# EAGLE design EthernetAppBoard-0BAC0403 (EAGLE 5.10)
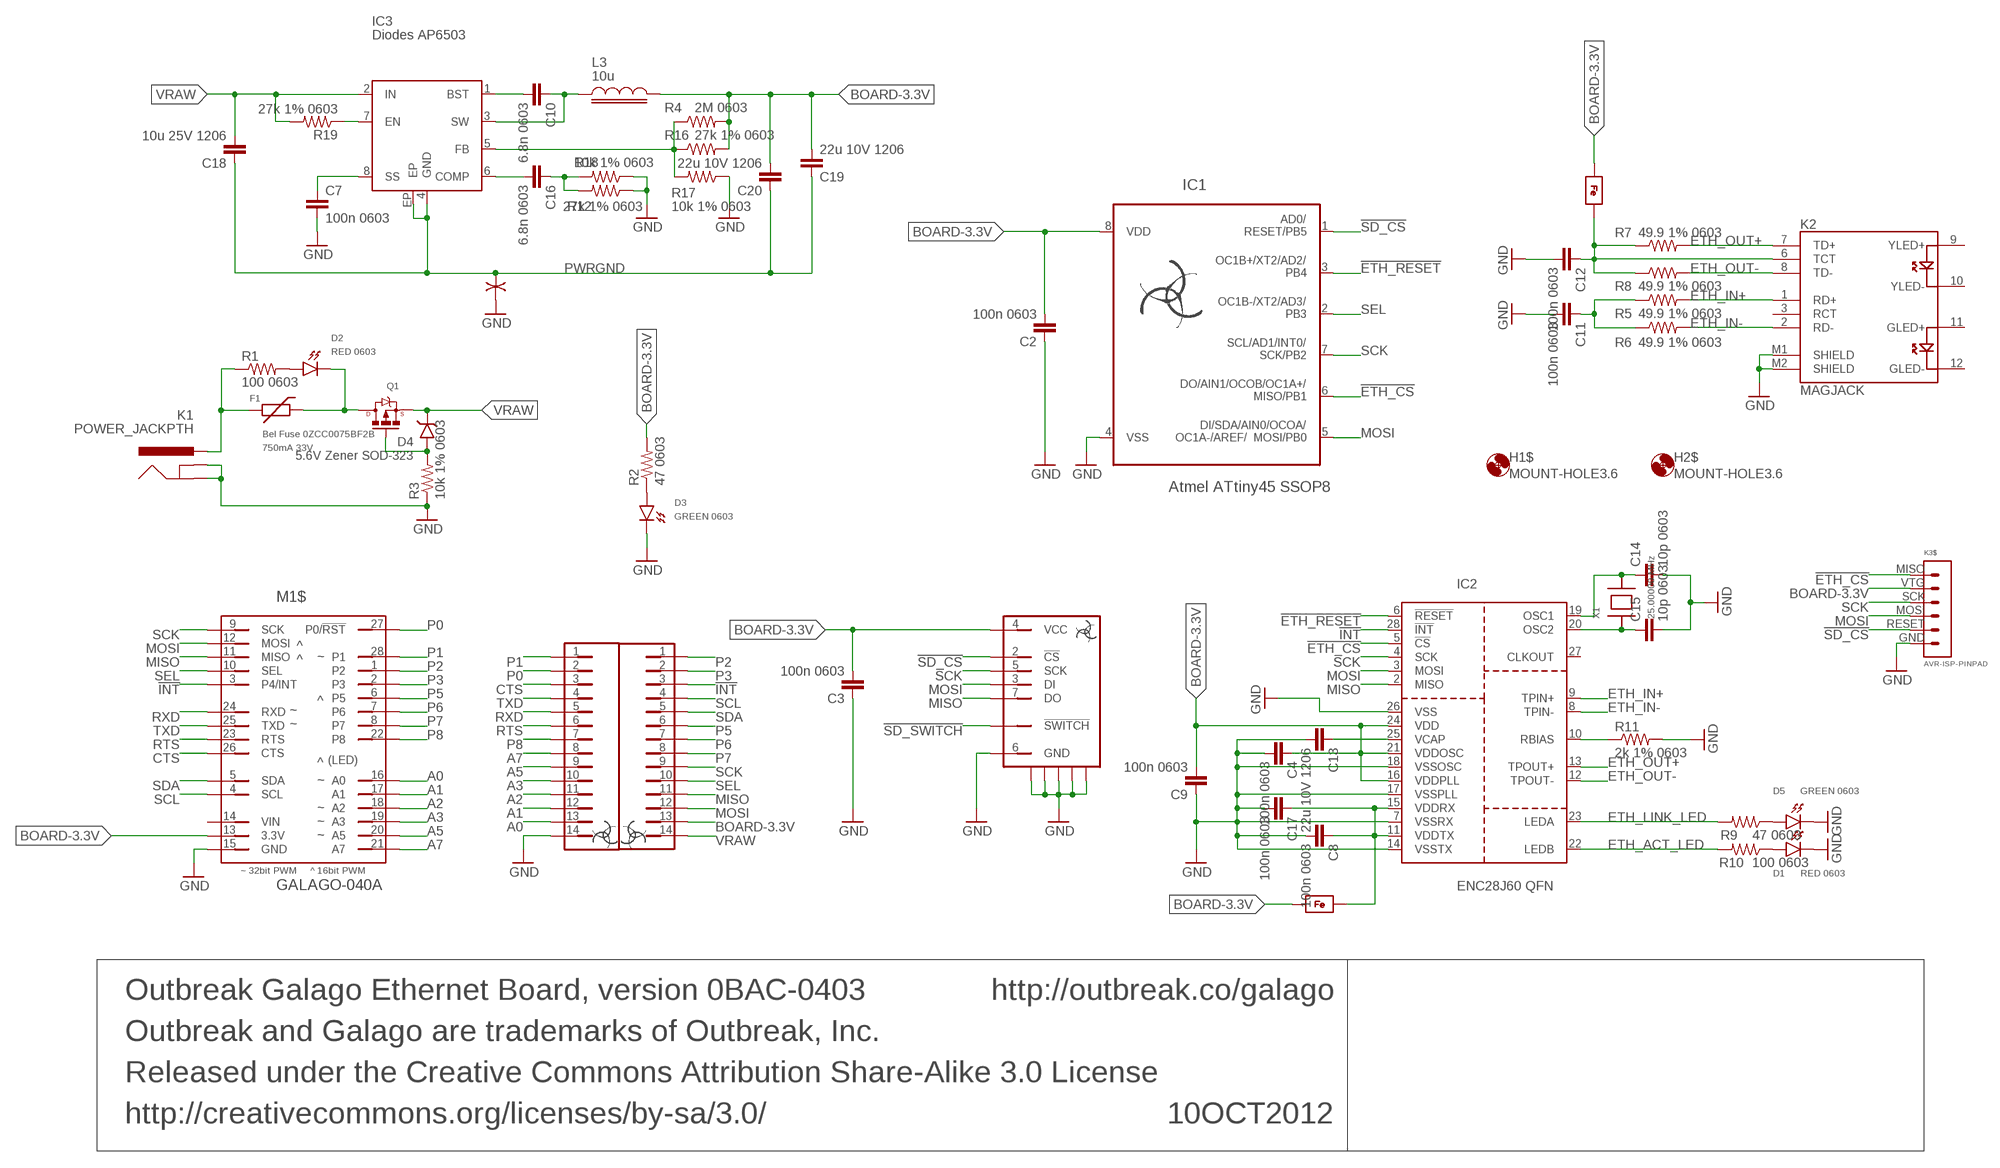
[diagram p0: schematic, sheet 1]

## Parts
10OCT2012  Outbreak Galago Ethernet Board, version 0BAC-0403  INFO-BLOCK  [INFO-BLOCK]
C2  100n 0603  CAP-0603  [0603]
C3  100n 0603  CAP-0603  [0603]
C4  100n 0603  CAP-0603  [0603]
C7  100n 0603  CAP-0603  [0603]
C8  100n 0603  CAP-0603  [0603]
C9  100n 0603  CAP-0603  [0603]
C10  6.8n 0603  CAP-0603  [0603]
C11  100n 0603  CAP-0603  [0603]
C12  100n 0603  CAP-0603  [0603]
C13  22u 10V 1206  CAP-1206  [1206]
C14  10p 0603  CAP-0603  [0603]
C15  10p 0603  CAP-0603  [0603]
C16  6.8n 0603  CAP-0603  [0603]
C17  100n 0603  CAP-0603  [0603]
C18  10u 25V 1206  CAP-1206  [1206]
C19  22u 10V 1206  CAP-1206  [1206]
C20  22u 10V 1206  CAP-1206  [1206]
D1  RED 0603  LED-0603  [0603-DIODE]
D2  RED 0603  LED-0603  [0603-DIODE]
D3  GREEN 0603  LED-0603  [0603-DIODE]
D4  5.6V Zener SOD-323  DIODE-ZENER-SOD323  [SOD-323]
D5  GREEN 0603  LED-0603  [0603-DIODE]
F1  Bel Fuse 0ZCC0075BF2B  PTC-1812-(4532-METRIC)  [1812-(4532-METRIC)-PTC]
FB1  800mA 60@100MHz 0603  FERRITE-BEAD-0603  [0603]
FB2  800mA 60@100MHz 0603  FERRITE-BEAD-0603  [0603]
H1$  MOUNT-HOLE3.6  [3,6]
H2$  MOUNT-HOLE3.6  [3,6]
IC1  Atmel ATtiny45 SSOP8  AVR-ATTINY25/45/85-TSSOP8  [TSSOP8]
IC2  ENC28J60 QFN  MICROCHIP-ENC28J60-ETHERNET-QFN  [QFN28-6X6MM-0.65MM]
IC3  Diodes AP6503  SWITCHING-REGULATOR-VARIABLE-BUCK-DIODES-AP6503  [EIAJ-SOIC8-3.9MM-EXPOSED-PAD]
K1  POWER_JACKPTH  [POWER_JACK_PTH]
K1$  HEADER-1X14-NO-SILK  [HEADER-1X14-NO-SILK]
K2  MAGJACK  [MAGJACK]
K2$  HEADER-1X14-NO-SILK  [HEADER-1X14-NO-SILK]
K3  MICROSD HIROSE-DM3D-SF  SD-OR-MICROSD-SPI-MODE-WITH-SWITCH-HIROSE-DM3D-SF  [HIROSE-MICROSD-SOCKET-DM3D-SF]
K3$  AVR-ISP-PINPAD  [AVR-ISP-PINPAD]
L3  10u  INDUCTOR-6X6MM  [INDUCTOR-SMD-6X6MM]
M1$  GALAGO-040A  [GALAGO]
Q1  Vishay SI2301CDS SOT23-3  MOSFET-P-CHANNEL-VISHAY-SI2301  [SOT23-3]
R1  100 0603  RESISTOR-0603  [0603]
R2  47 0603  RESISTOR-0603  [0603]
R3  10k 1% 0603  RESISTOR-0603  [0603]
R4  2M 0603  RESISTOR-0603  [0603]
R5  49.9 1% 0603  RESISTOR-0603  [0603]
R6  49.9 1% 0603  RESISTOR-0603  [0603]
R7  49.9 1% 0603  RESISTOR-0603  [0603]
R8  49.9 1% 0603  RESISTOR-0603  [0603]
R9  47 0603  RESISTOR-0603  [0603]
R10  100 0603  RESISTOR-0603  [0603]
R11  2k 1% 0603  RESISTOR-0603  [0603]
R12  27k 1% 0603  RESISTOR-0603  [0603]
R16  27k 1% 0603  RESISTOR-0603  [0603]
R17  10k 1% 0603  RESISTOR-0603  [0603]
R18  10k 1% 0603  RESISTOR-0603  [0603]
R19  27k 1% 0603  RESISTOR-0603  [0603]
U$1  GND-ISOLATOR-0.016"  [GND-ISOLATOR-0.016"]
X1  25.00000 MHz  CRYSTAL-NDK-NX3225GA  [CRYSTAL-NDK-NX3225GA]

## Nets
!ETH_CS: IC1.6(MISO/PB1) IC2.5(!CS) K3$.MISO
!ETH_RESET: IC1.3(PB4) IC2.6(!RESET)
!INT: IC2.28(!INT) K2$.3 M1$.3(P4/INT)
!SD_CS: IC1.1(RESET/PB5) K3$.RESET K3.2(!CS)
!SD_SWITCH: K3.SWITCH(!SWITCH)
A0: K1$.13 M1$.16(A0)
A1: K1$.12 M1$.17(A1)
A2: K1$.11 M1$.18(A2)
A3: K1$.10 M1$.19(A3)
A5: K1$.9 M1$.20(A5)
A7: K1$.8 M1$.21(A7)
BOARD-3.3V: C2.1 C3.1 C4.2 C9.1 C19.1 C20.1 FB1.1 FB2.1 IC1.8(VDD) IC2.16(VDDPLL) IC2.21(VDDOSC) IC2.24(VDD) K2$.13 K3$.VTG K3.4(VCC) L3.2 M1$.13(3.3V) R2.2 R4.2 R16.2
CTS: K1$.3 M1$.26(CTS)
ETH-OSC1: C14.2 IC2.19(OSC1) X1.3
ETH-OSC2: C15.2 IC2.20(OSC2) X1.1
ETH_ACT_LED: IC2.22(LEDB) R10.2
ETH_IN+: IC2.9(TPIN+) K2.1(RD+) R5.2
ETH_IN-: IC2.8(TPIN-) K2.2(RD-) R6.2
ETH_LINK_LED: IC2.23(LEDA) R9.2
ETH_OUT+: IC2.13(TPOUT+) K2.7(TD+) R7.2
ETH_OUT-: IC2.12(TPOUT-) K2.8(TD-) R8.2
GND: C2.2 C3.2 C4.1 C7.1 C8.1 C9.2 C11.1 C12.1 C13.1 C14.1 C15.1 C17.1 D1.2(K) D3.2(K) D5.2(K) IC1.4(VSS) IC2.7(VSSRX) IC2.14(VSSTX) IC2.17(VSSPLL) IC2.18(VSSOSC) IC2.26(VSS) K1$.14 K1.GND K1.GNDBREAK K2.M1(SHIELD) K2.M2(SHIELD) K3$.GND K3.6(GND) K3.PP$1 K3.PP$2 K3.PP$3 K3.PP$4 K3.PP$5 M1$.15(GND) R3.1 R11.2 R12.1 R17.1 R18.1 U$1.A
IBIAS: IC2.10(RBIAS) R11.1
MISO: IC2.2(MISO) K2$.11 K3.7(DO) M1$.11(MISO)
MOSI: IC1.5(MOSI/PB0) IC2.3(MOSI) K2$.12 K3$.MOSI K3.3(DI) M1$.12(MOSI)
N$1: D2.1(A) R1.2
N$2: D3.1(A) R2.1
N$3: F1.1 K1.PWR R1.1
N$5: D2.2(K) F1.2 Q1.3(DRAIN)
N$6: C11.2 R5.1 R6.1
N$9: C12.2 FB1.2 K2.6(TCT) R7.1 R8.1
N$10: D1.1(A) R10.1
N$11: D5.1(A) R9.1
N$26: C16.2 R12.2 R18.2
P0: K1$.2 M1$.27(P0/!RST)
P1: K1$.1 M1$.28(P1)
P2: K2$.1 M1$.1(P2)
P3: K2$.2 M1$.2(P3)
P5: K2$.6 M1$.6(P5)
P6: K2$.7 M1$.7(P6)
P7: K2$.8 M1$.8(P7)
P8: K1$.7 M1$.22(P8)
PMOS-GATE: D4.A Q1.1(GATE) R3.2
POWER-BOOST: C10.1 IC3.1(BST)
POWER-COMP: C16.1 IC3.6(COMP)
POWER-EN: IC3.7(EN) R19.1
POWER-FB: IC3.5(FB) R4.1 R16.1 R17.2
POWER-SS: C7.2 IC3.8(SS)
POWER-SW: C10.2 IC3.3(SW) L3.1
PWRGND: C18.2 C19.2 C20.2 IC3.4(GND) IC3.EP U$1.B
RTS: K1$.6 M1$.23(RTS)
RXD: K1$.5 M1$.24(RXD)
SCK: IC1.7(SCK/PB2) IC2.4(SCK) K2$.9 K3$.SCK K3.5(SCK) M1$.9(SCK)
SCL: K2$.4 M1$.4(SCL)
SDA: K2$.5 M1$.5(SDA)
SEL: IC1.2(PB3) K2$.10 M1$.10(SEL)
TXD: K1$.4 M1$.25(TXD)
VCAP: C13.2 IC2.25(VCAP)
VDDTX-RX: C8.2 C17.2 FB2.2 IC2.11(VDDTX) IC2.15(VDDRX)
VRAW: C18.1 D4.K IC3.2(IN) K2$.14 Q1.2(SOURCE) R19.2
Unconnected: IC2.27(CLKOUT) K2.3(RCT) K2.9(YLED+) K2.10(YLED-) K2.11(GLED+) K2.12(GLED-) M1$.14(VIN)

## Notes on the sheet
- 750mA 33V

## Library data of the parts
10OCT2012 = Outbreak:INFO-BLOCK
C2-C4 C7-C20 = Outbreak:CAP
D1-D3 D5 = Outbreak:LED
D4 = Outbreak:DIODE-ZENER
F1 = Outbreak:PTC
FB1 FB2 = Outbreak:FERRITE-BEAD
H1$ H2$ = holes:MOUNT-HOLE: MOUNTING HOLE with drill center marker
IC1 = Outbreak:AVR-ATTINY25/45/85
IC2 = Outbreak:MICROCHIP-ENC28J60-ETHERNET
IC3 = Outbreak:SWITCHING-REGULATOR-VARIABLE-BUCK-DIODES-AP6503
K1 = SparkFun:POWER_JACK: Power Jack This is the standard 5.5mm barrel jack for power. The PTH is the most common, proven, reliable, footprint. All others are experimental. The Slot footprint only works if the mill layer is transmitted to the PCB fab house so be warned. Spark Fun Electronics SKU : PRT-00119. Mating wall wart : TOL-00298 (and others)
K1$ K2$ = Outbreak:HEADER-1X14-NO-SILK
K2 = SparkFun:MAGJACK
K3 = Outbreak:SD-OR-MICROSD-SPI-MODE-WITH-SWITCH
K3$ = Outbreak:AVR-ISP-PINPAD
L3 = Outbreak:INDUCTOR
M1$ = Outbreak-v0:GALAGO-040A
Q1 = Outbreak:MOSFET-P-CHANNEL
R1-R12 R16-R19 = Outbreak:RESISTOR: Resistor Basic schematic elements and footprints for 0603, 1206, and PTH resistors.
U$1 = Outbreak:GND-ISOLATOR
X1 = Outbreak:CRYSTAL

## Board
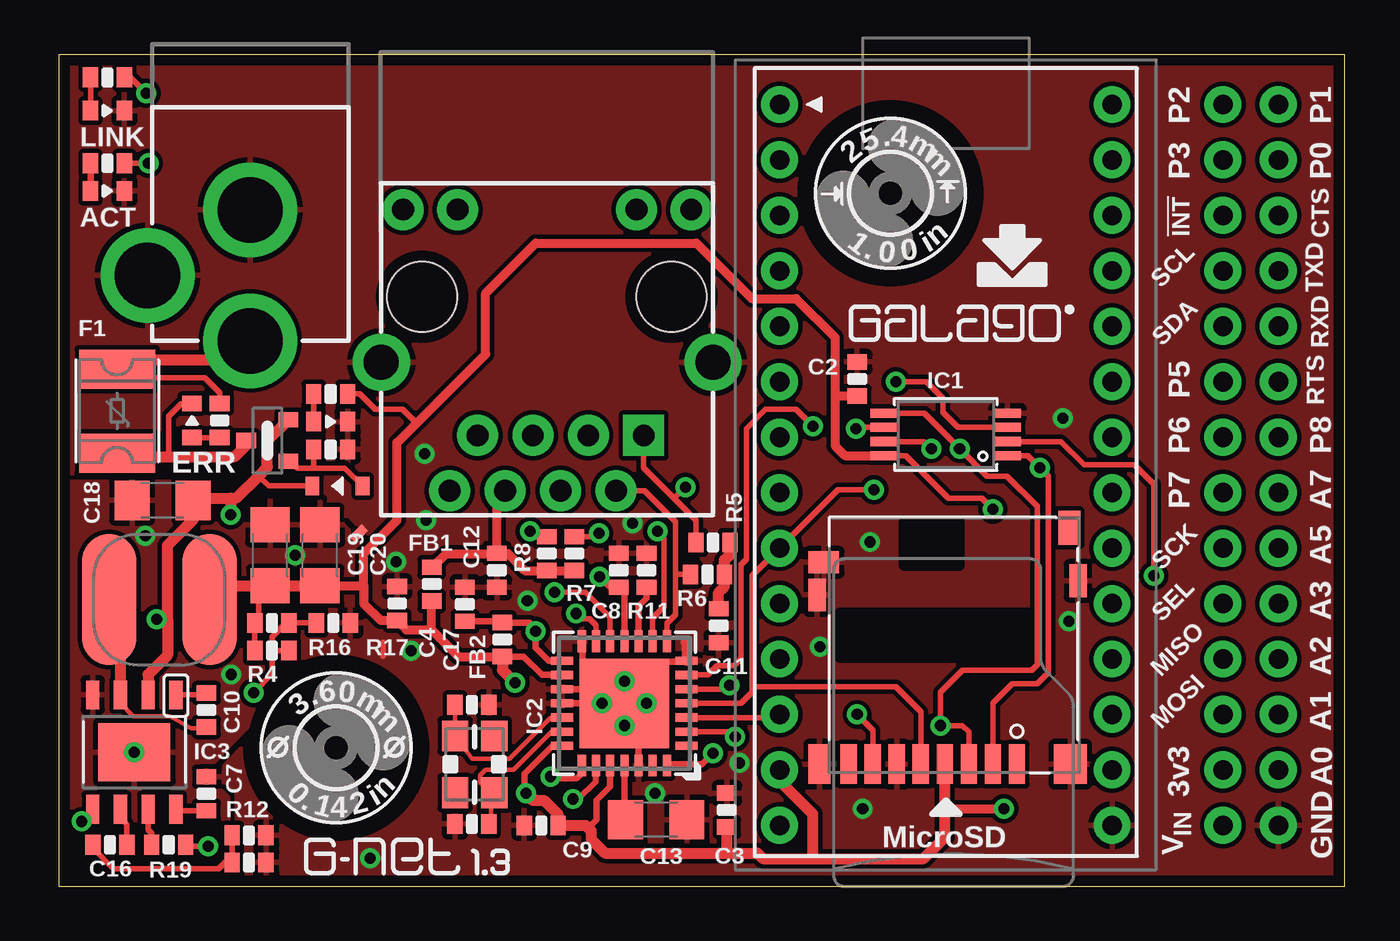
[diagram p1: board, top side]
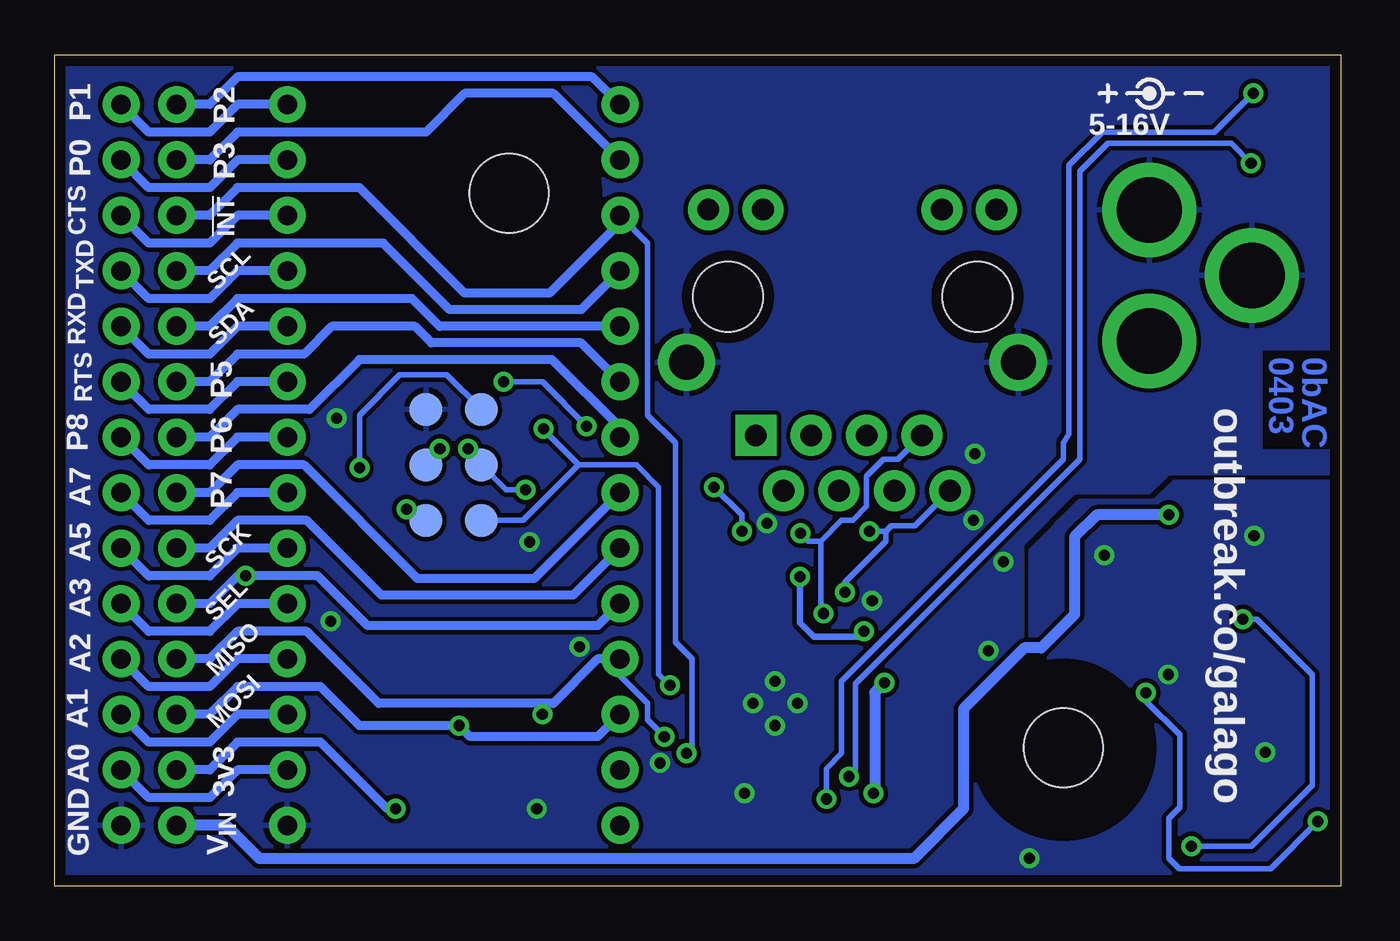
[diagram p2: board, bottom side, seen from below]

Size 58.93 x 38.1 mm. Coordinates in mm from the lower left corner, seen from the top.
Outline: 0,0 58.93,0 58.93,38.1 0,38.1 0,0
Copper layers (1*16): Top 0.035mm / dielectric 1.5mm / Bottom 0.035mm
Design rules "default *": minimum track width 8mil, minimum drill 20mil, track to track 8mil, track to pad 8mil, pad to pad 8mil, via to via 8mil, smd to smd 8mil, copper to edge 20mil, drill to drill 8mil, minimum pad ring 10mil, minimum via ring 8mil, stop-mask expansion 4mil, vias tented up to drill 20mil, thermal gap 10mil

### Footprints (pad centres in the part's own frame; a part is rotated, then mirrored left to right if it is on the bottom)
0603 = smd 0.7 x 0.9: 1 -0.777,0; 2 0.777,0
1206 = smd 1.6 x 1.8: 1 -1.4,0; 2 1.4,0
0603-DIODE = smd 0.7 x 0.9: 1 -0.777,0; 2 0.777,0
SOD-323 = smd 0.63 x 0.83: A -1.15,0; K 1.15,0
1812-(4532-METRIC)-PTC = smd 1.78 x 3.5: 1 -1.922,0.002; 2 1.938,0.002
3,6 = hole 3.6: 0,0
TSSOP8 = smd 1.25 x 0.42: 1 -2.825,0.975; 2 -2.825,0.325; 3 -2.825,-0.325; 4 -2.825,-0.975; 5 2.825,-0.975; 6 2.825,-0.325; 7 2.825,0.325; 8 2.825,0.975
QFN28-6X6MM-0.65MM = smd 1 x 0.37: 1 -2.85,1.95; 2 -2.85,1.3; 3 -2.85,0.65; 4 -2.85,0; 5 -2.85,-0.65; 6 -2.85,-1.3; 7 -2.85,-1.95; 15 2.85,-1.95; 16 2.85,-1.3; 17 2.85,-0.65; 18 2.85,0; 19 2.85,0.65; 20 2.85,1.3; 21 2.85,1.95 | smd 0.37 x 1: 8 -1.95,-2.85; 9 -1.3,-2.85; 10 -0.65,-2.85; 11 0,-2.85; 12 0.65,-2.85; 13 1.3,-2.85; 14 1.95,-2.85; 22 1.95,2.85; 23 1.3,2.85; 24 0.65,2.85; 25 0,2.85; 26 -0.65,2.85; 27 -1.3,2.85; 28 -1.95,2.85 | smd 4.1 x 4.1: PAD 0,0
EIAJ-SOIC8-3.9MM-EXPOSED-PAD = smd 1.321 x 0.61: 1 -2.618,1.905; 2 -2.618,0.635; 3 -2.618,-0.635; 4 -2.618,-1.905; 5 2.618,-1.905; 6 2.618,-0.635; 7 2.618,0.635; 8 2.618,1.905 | smd 2.66 x 3.3: EP 0,0
POWER_JACK_PTH = drill 2.997 pad 4.318 round: GND 0,7.7; GNDBREAK 4.7,10.7; PWR 0,13.7
HEADER-1X14-NO-SILK = drill 0.9 round: 1 0,0; 2 2.54,0; 3 5.08,0; 4 7.62,0; 5 10.16,0; 6 12.7,0; 7 15.24,0; 8 17.78,0; 9 20.32,0; 10 22.86,0; 11 25.4,0; 12 27.94,0; 13 30.48,0; 14 33.02,0
MAGJACK = drill 1 pad 1.88 square: 1 3.175,17.445 | drill 1 pad 1.88 round: 2 4.445,19.985; 3 5.715,17.445; 4 6.985,19.985; 5 8.255,17.445; 6 9.525,19.985; 7 10.795,17.445; 8 12.065,19.985 | drill 1 pad 1.27 round: 9 1,7.1; 10 3.5,7.1; 11 11.7,7.1; 12 14.2,7.1 | drill 1.6 pad 2.184 round: M1 0,14.1; M2 15.2,14.1 | hole 3.2: 1.905,11.095; 13.335,11.095
HIROSE-MICROSD-SOCKET-DM3D-SF = smd 0.75 x 1.8: 1 2.62,-4.18; 2 1.52,-4.18; 3 0.42,-4.18; 4 -0.68,-4.18; 5 -1.78,-4.18; 6 -2.88,-4.18; 7 -3.98,-4.18; 8 -5.08,-4.18 | smd 1.4 x 1: PP$1 -6.23,5.07 | smd 0.8 x 1.5: PP$2 -6.53,3.57; PP$5 5.42,4.22 | smd 1 x 1.8: PP$3 -6.43,-4.18 | smd 1.5 x 1.8: PP$4 5.07,-4.18 | smd 1 x 1.55: SWITCH 5.02,6.645
AVR-ISP-PINPAD = smd 1.524 x 1.524: GND 2.54,1.27; MISO -2.54,-1.27; MOSI 0,1.27; RESET 2.54,-1.27; SCK 0,-1.27; VTG -2.54,1.27
INDUCTOR-SMD-6X6MM = smd 2.5 x 6: 1 -2.3,0; 2 2.3,0
GALAGO = drill 0.9 pad 1.651 round: 1 -7.62,16.51; 2 -7.62,13.97; 3 -7.62,11.43; 4 -7.62,8.89; 5 -7.62,6.35; 6 -7.62,3.81; 7 -7.62,1.27; 8 -7.62,-1.27; 9 -7.62,-3.81; 10 -7.62,-6.35; 11 -7.62,-8.89; 12 -7.62,-11.43; 13 -7.62,-13.97; 14 -7.62,-16.51; 15 7.62,-16.51; 16 7.62,-13.97; 17 7.62,-11.43; 18 7.62,-8.89; 19 7.62,-6.35; 20 7.62,-3.81; 21 7.62,-1.27; 22 7.62,1.27; 23 7.62,3.81; 24 7.62,6.35; 25 7.62,8.89; 26 7.62,11.43; 27 7.62,13.97; 28 7.62,16.51
SOT23-3 = smd 0.7 x 0.9: 1 0.95,0.97; 2 -0.95,0.97; 3 0,-0.97
GND-ISOLATOR-0.016" = smd 0.406 x 0.406: A -0.191,0; B 0.191,0
CRYSTAL-NDK-NX3225GA = smd 1.4 x 1.2: 1 -1.3,-0.9; 2 1.3,-0.9; 3 1.3,0.9; 4 -1.3,0.9

### Placement (x,y rotation side)
10OCT2012  32.77,-15.62 0 top  (outside the outline)
C2  36.58,23.24 90 top
C3  30.61,3.49 90 top
C4  15.49,12.95 270 top
C7  6.76,4.24 270 top
C8  25.65,14.48 270 top
C9  22.1,2.79 180 top
C10  6.76,8.08 270 top
C11  30.23,11.94 90 top
C12  20.07,14.48 90 top
C13  27.37,3.05 180 top
C14  18.92,8.32 180 top
C15  18.92,2.86 0 top
C16  2.34,1.91 180 top
C17  18.61,12.92 270 top
C18  4.75,17.68 180 top
C19  9.68,15.16 90 top
C20  11.96,15.16 90 top
D1  2.22,31.85 0 top
D2  6.1,21.34 90 top
D3  12.45,21.29 0 top
D4  12.76,18.34 180 top
D5  2.22,35.53 0 top
F1  2.67,21.77 270 top
FB1  17.08,13.84 90 top
FB2  20.32,11.3 90 top
H1$  12.7,6.35 0 top
H2$  38.1,31.75 0 top
IC1  40.64,20.7 180 top
IC2  25.91,8.38 180 top
IC3  3.45,6.15 270 top
K1  8.76,38.68 180 top
K1$  55.88,35.81 270 top
K2  29.97,38.1 180 top
K2$  53.34,35.81 270 top
K3  41.27,9.78 0 top
K3$  40.64,19.3 90 bottom
L3  4.6,13.13 0 top
M1$  40.64,19.3 0 top
Q1  9.55,20.42 270 top
R1  7.37,21.34 270 top
R2  12.45,22.56 0 top
R3  12.45,20.02 180 top
R4  9.75,10.79 180 top
R5  29.97,15.75 180 top
R6  29.72,14.29 180 top
R7  23.62,15.24 90 top
R8  22.35,15.24 90 top
R9  2.22,37.06 0 top
R10  2.22,33.12 0 top
R11  26.92,14.48 90 top
R12  8.71,1.09 180 top
R16  9.75,12.06 180 top
R17  12.57,12.06 180 top
R18  8.71,2.34 180 top
R19  5.03,1.91 0 top
U$1  13.73,16.15 225 top
U$2  [GALAGO-LOGO]  41.15,25.78 0 top
U$4  [GALAGO-APP-BOARD-SYMBOL]  43.69,28.32 0 top
X1  19.05,5.59 90 top

### Tracks (layer width: path | path; a pad name or v marks a point on that pad's centre or on a via)
!ETH_CS  (via drill 0.51)
  Top 0.254: v30.73,9.21 30.56,9.03 IC2.5 | IC1.6 36.6,21.03 v36.52,20.95
  Bottom 0.254: v30.73,9.21 31.24,9.72 31.24,18.29 32.26,19.3 34.92,19.3 | 34.92,19.3 37.47,16.76 K3$.MISO | 34.92,19.3 36.52,20.9 v36.52,20.95
!ETH_RESET  (via drill 0.51)
  Top 0.254: IC2.6 29.75,9.68 30.16,10.1 30.92,10.1 31.24,10.41 31.24,14.73 31.5,14.99 31.5,20.95 32.38,21.84 33.78,21.84 v34.54,21.08 | IC1.3 41.2,21.03 40.51,21.72 40.51,22.35 39.75,23.11 v38.35,23.11
  Bottom 0.254: v34.54,21.08 36.58,23.11 v38.35,23.11
!INT  (via drill 0.51)
  Top 0.305: v29.97,6.1 29.46,5.59 27.91,5.59 IC2.28
  Bottom 0.254: v29.97,6.1 29.72,6.35 29.72,10.41 30.48,11.18 30.48,20.32 31.75,21.59 31.75,29.46 M1$.3
  Bottom 0.406: K2$.3 51.82,30.73 50.55,32 44.96,32 40.13,27.18 36.25,27.18 33.02,30.4 M1$.3
!SD_CS  (via drill 0.51)
  Top 0.254: K3.2 42.8,8.38 43.69,9.27 44.83,9.27 45.34,9.78 45.34,18.8 v44.96,19.18 44.41,19.73 IC1.1
  Bottom 0.254: K3$.RESET 40.96,23.43 43.12,23.43 44.96,21.59 v44.96,19.18
A0
  Bottom 0.406: K1$.13 54.61,4.06 51.82,4.06 50.55,5.33 M1$.16
A1
  Bottom 0.406: K1$.12 54.61,6.6 51.82,6.6 50.55,7.87 M1$.17
A2
  Bottom 0.406: K1$.11 54.61,9.14 51.82,9.14 50.55,10.41 M1$.18
A3
  Bottom 0.406: K1$.10 54.61,11.68 51.82,11.68 50.55,12.95 M1$.19
A5
  Bottom 0.406: K1$.9 54.61,14.22 51.82,14.22 50.55,15.49 M1$.20
A7
  Bottom 0.406: K1$.8 54.61,16.76 51.82,16.76 50.55,18.03 M1$.21
BOARD-3.3V  (via drill 0.51)
  Top 0.254: 6.9,10.7 L3.2 | R2.2 13.77,22.55 14.48,21.84 15.75,21.84 16.38,21.21 | 9.27,13.76 9.14,13.76 9.14,12.11 R16.2 R4.2 | IC1.8 38.82,19.73 40.77,17.78 42.29,17.78 v42.8,17.27
  Top 0.305: IC2.21 22.61,6.43 21.34,5.16 21.34,4.32 v21.4,4.25 | IC2.24 25.26,4.56 24.64,3.94 24.64,3.05 24.38,2.79 24.13,2.79 | IC2.16 22.13,9.68 21.28,10.53 FB2.1 | 22.95,3.05 C9.1
  Top 0.406: 40.59,3.56 v43.31,3.56 | FB2.1 18.3,10.53 17.08,11.75 | 17.08,11.75 FB1.1 | 17.08,11.75 15.92,11.75 C4.2 14.75,12.18 13.97,12.95 13.97,13.76 | 13.97,13.76 13.97,15.24 15.49,16.76 15.49,20.32 16.38,21.21 19.56,24.38 19.56,27.18 21.84,29.46 29.21,29.46 31.75,26.92 33.78,26.92 35.56,25.15 35.56,22.46 | C20.1 13.97,13.76 | IC1.8 36.03,19.73 35.56,20.19 35.56,22.46 | 35.56,22.46 C2.1
  Top 0.508: 22.95,3.05 22.86,3.05 22.86,3.3 22.23,3.94 21.72,3.94 v21.4,4.25 | K3.4 40.59,3.56 40.59,2.24 39.62,1.27 34.54,1.27 | 30.73,1.52 25.02,1.52 24.38,2.16 24.38,2.54 24.13,2.79 C9.1 | 30.73,1.52 32,1.52 32.26,1.27 34.54,1.27 | 34.54,1.27 34.54,3.3 33.02,4.83 M1$.13 | C3.1 30.61,1.65 30.73,1.52 | L3.2 6.9,13.76 9.27,13.76 C19.1 C20.1 | v20.9,9.32 20.32,9.91 FB2.1
  Bottom 0.254: v42.8,17.27 42.42,17.27 K3$.VTG
  Bottom 0.406: K2$.13 51.82,5.33 50.55,6.6 46.74,6.6 43.69,3.56 v43.31,3.56
  Bottom 0.508: v21.4,4.25 21.34,4.32 21.34,8.89 v20.9,9.32
CTS
  Bottom 0.406: K1$.3 54.61,29.46 51.82,29.46 50.55,30.73 M1$.26
ETH-OSC1
  Top 0.203: C14.2 X1.3 18.94,5.84 20.64,5.84 22.53,7.73 IC2.19
ETH-OSC2
  Top 0.203: IC2.20 22.58,7.08 20.83,5.33 19.56,5.33 19.3,5.08 19.3,4.78 19.79,4.29 | X1.1 19.79,4.29 | 19.79,4.29 19.79,2.86 C15.2
ETH_ACT_LED  (via drill 0.51)
  Top 0.254: v4.1,33.12 R10.2
  Top 0.282: IC2.22 23.96,5.16 23.75,4.95 22.61,4.95 v22.53,5.03
  Bottom 0.254: v4.1,33.12 5.02,34.04 10.67,34.04 11.94,32.77 11.94,19.56 22.23,9.27 22.23,5.33 v22.53,5.03
ETH_IN+  (via drill 0.51)
  Top 0.254: IC2.9 27.21,12.29 27.74,12.81 27.74,15.95 v27.43,16.26 | K2.1 26.8,19.18 28.19,17.78 | R5.2 29.2,16.78 28.19,17.78 | v28.7,18.29 28.19,17.78
  Bottom 0.254: v27.43,16.26 27.43,17.02 v28.7,18.29
ETH_IN-
  Top 0.254: IC2.8 27.86,12.05 28.26,12.45 28.26,14.29 | 28.26,14.29 28.26,16.7 26.84,18.11 K2.2 | 28.26,14.29 R6.2
ETH_LINK_LED  (via drill 0.51)
  Top 0.254: v4,36.32 3.26,37.06 R9.2
  Top 0.282: IC2.23 24.61,4.8 23.81,4 v23.56,4
  Bottom 0.254: v4,36.32 5.78,34.54 10.92,34.54 12.45,33.02 12.45,20.7 12.7,20.32 12.7,19.56 22.86,9.4 22.86,6.1 23.56,5.4 v23.56,4
ETH_OUT+  (via drill 0.51)
  Top 0.254: IC2.13 24.61,11.97 24.32,12.26 23.93,12.26 v23.69,12.5 | R7.2 24.58,16.02 v24.74,16.18
  Bottom 0.254: v23.69,12.5 23.81,12.62 23.81,15.81 | 23.81,15.81 22.86,16.76 22.35,16.76 21.72,17.4 21.72,18.8 20.95,19.56 20.27,19.56 K2.7 | 23.81,15.81 24.37,15.81 v24.74,16.18
ETH_OUT-  (via drill 0.51)
  Top 0.254: IC2.12 25.26,12.33 24.13,13.46 v22.71,13.46 | R8.2 21.83,16.02 v21.59,16.26
  Bottom 0.254: K2.8 19.51,16.51 20.57,16.51 20.83,16.26 | v22.71,13.46 22.71,13.92 20.83,15.8 20.83,16.26 | 20.83,16.26 v21.59,16.26
GND  (via drill 0.51)
  Top 0.254: IC2.7 28.76,10.29 28.83,10.29 | R12.1 9.69,0.89 | 14.86,11.18 14.86,10.54
  Top 0.305: IC2.17 24,9.03 24,11.23 | IC2.18 v24.89,8.38 | 26.92,10.29 28.83,10.29 | IC2.26 26.56,7.37 | 24,11.23 24,11.3 | 24,11.23 IC2.14
  Top 0.406: IC2.7 28.76,11.18 28.7,11.18
  other vias: 25.91,9.4 26.92,8.38 25.91,7.37 16.13,10.79 26.29,16.64 46,21.44 16.81,16.76 37.16,15.77 46.28,12.14 31.18,5.65 14.25,1.3 16.76,19.81 21.46,13.08 36.83,3.56 27.3,4.25 15.44,14.86 34.87,10.97
  pour Top (isolate 0.203, rank 3): 0,38.1 58.93,38.1 58.93,0 0,0
  pour Bottom (isolate 0.203, rank 2): 0,38.1 0,24.64 3.68,24.64 3.68,19.94 0,19.94 0,0 58.93,0 58.93,38.1
IBIAS
  Top 0.305: IC2.10 26.56,12.83 26.92,13.19 R11.1
MISO  (via drill 0.51)
  Top 0.254: IC2.2 30.76,7.08 v30.99,6.86 | K3.7 37.3,7.16 v36.58,7.87
  Bottom 0.254: v30.99,6.86 31.75,7.62 31.75,8.38 33.02,9.65 M1$.11 | 36.58,8.38 v36.58,7.87
  Bottom 0.406: K2$.11 51.82,10.41 50.55,11.68 47.37,11.68 44.07,8.38 36.58,8.38 36.07,8.38 34.04,10.41 M1$.11
MOSI  (via drill 0.51)
  Top 0.254: IC2.3 32.88,7.73 M1$.12 | K3.3 41.7,7.07 41.4,7.37 v40.39,7.37 40.39,8.89 41.4,9.91 44.58,9.91 44.83,10.16 44.83,17.4 43.43,18.8 42.53,18.8 v41.27,20.05 39.65,21.68 IC1.5
  Bottom 0.254: v41.27,20.05 41.91,19.42 K3$.MOSI
  Bottom 0.406: K2$.12 51.82,7.87 50.55,9.14 46.74,9.14 44.96,7.37 v40.39,7.37 39.88,6.86 34.04,6.86 M1$.12
N$1
  Top 0.254: R1.2 D2.1
N$2
  Top 0.254: R2.1 D3.1
N$3
  Top 0.254: F1.1 3.3,23.69 3.3,23.3 6.67,23.3 7.37,22.61 R1.1
  Top 0.508: 3.3,23.69 3.3,24.13 7.91,24.13 K1.PWR
N$5
  Top 0.254: D2.2 5.6,22.11 5.02,21.53 5.02,19.65 3.97,19.65
  Top 0.508: F1.2 3.97,19.65 3.97,19.68 8.05,19.68 8.58,20.21 Q1.3
N$6
  Top 0.508: 30.73,15.75 R5.1 30.75,15.19 30.5,14.94 R6.1 30.5,13.73 30.23,13.46 C11.2
N$9
  Top 0.406: R7.1 R8.1 21.34,14.46 20.57,15.22 20.57,15.24 | K2.6 20.07,17.73 C12.2 20.57,15.24 | FB1.2 17.11,14.62 17.73,15.24 20.57,15.24
N$10
  Top 0.305: D1.1 R10.1
N$11
  Top 0.254: D5.1 R9.1
N$26
  Top 0.254: 7.93,1.43 7.32,0.81 2.49,0.81 1.56,1.74 C16.2 | 7.93,1.43 R18.2 | 7.93,1.43 R12.2
P0
  Bottom 0.406: K1$.2 54.61,32 51.82,32 50.55,33.27 M1$.27
P1
  Bottom 0.406: K1$.1 54.61,34.54 51.82,34.54 50.55,35.81 M1$.28
P2
  Bottom 0.406: K2$.1 51.82,35.81 50.55,37.08 34.29,37.08 M1$.1
P3
  Bottom 0.406: K2$.2 51.82,33.27 50.55,34.54 41.91,34.54 40.13,36.32 36.07,36.32 M1$.2
P5
  Bottom 0.406: K2$.6 51.82,23.11 50.55,24.38 47.5,24.38 46.23,25.65 42.42,25.65 41.66,24.89 34.8,24.89 M1$.6
P6
  Bottom 0.406: K2$.7 51.82,20.57 50.55,21.84 47.24,21.84 44.96,24.13 36.13,24.13 33.02,21.02 M1$.7
P7
  Bottom 0.406: K2$.8 51.82,18.03 50.55,19.3 47.5,19.3 42.29,14.1 36.96,14.1 M1$.8
P8
  Bottom 0.406: K1$.7 54.61,19.3 51.82,19.3 50.55,20.57 M1$.22
PMOS-GATE
  Top 0.254: D4.A 13.1,19.15 11.67,19.15 | R3.2 11.67,19.15 | 11.67,19.15 10.95,19.15 10.63,19.47 Q1.1
POWER-BOOST
  Top 0.254: IC3.1 6.76,8.77 C10.1
POWER-COMP
  Top 0.254: IC3.6 2.82,3.15 3.11,2.85 C16.1
POWER-EN
  Top 0.254: IC3.7 4.09,2.59 4.25,2.43 R19.1
POWER-FB  (via drill 0.51)
  Top 0.254: v1.04,2.97 1.55,3.48 IC3.5 | R17.2 R16.1 10.41,12.06 9.78,11.43 9.78,10.79 | v8.91,8.87 9.78,9.73 9.78,10.79 | 9.78,10.79 R4.1
  Bottom 0.254: v1.04,2.97 3.2,0.81 7.39,0.81 7.87,1.29 7.87,3.12 7.37,3.63 7.37,6.93 8.91,8.48 v8.91,8.87
POWER-SS
  Top 0.254: IC3.8 5.36,3.47 C7.2
POWER-SW
  Top 0.203: IC3.3 2.82,8.38 3.4,7.8 5.08,7.8 6.07,7.24 6.76,7.24 C10.2
  Top 0.508: IC3.3 2.82,13.13 L3.1
PWRGND  (via drill 0.51)
  other vias: 3.45,6.15 7.9,9.7 10.82,15.16 3.96,16.05
  pour Bottom: 0,18.54 7.62,18.54 8.51,17.65 11.94,17.65 14.22,15.37 14.22,10.03 11.05,10.03 7.37,6.35 7.37,0 0,0
  pour Top: 0,18.54 7.62,18.54 8.51,17.65 11.94,17.65 14.22,15.37 14.22,12.7 13.72,12.32 10.79,12.32 9.78,11.43 9.78,8.51 7.11,5.71 6.35,5.71 6.35,4.57 7.24,4.57 7.75,4.06 7.75,0 0,0
RTS
  Bottom 0.406: K1$.6 54.61,21.84 51.82,21.84 50.55,23.11 M1$.23
RXD
  Bottom 0.406: K1$.5 54.61,24.38 51.82,24.38 50.55,25.65 M1$.24
SCK  (via drill 0.51)
  Top 0.254: IC2.4 31.24,8.38 31.75,8.89 31.75,9.14 | 31.75,9.14 31.75,14.22 M1$.9 35.69,18.16 v37.34,18.16 | K3.5 39.49,8 38.35,9.14 31.75,9.14 | v39.98,20.05 39.64,20.38 IC1.7
  Bottom 0.254: v39.98,20.05 K3$.SCK 38.23,18.16 v37.34,18.16
  Bottom 0.406: K2$.9 51.82,15.49 50.55,16.76 47.37,16.76 43.94,13.34 35.18,13.34 M1$.9
SCL
  Bottom 0.406: K2$.4 51.82,28.19 50.55,29.46 43.87,29.46 40.82,26.42 34.8,26.42 M1$.4
SDA
  Bottom 0.406: K2$.5 51.82,25.65 50.55,26.92 42.55,26.92 41.27,25.65 M1$.5
SEL  (via drill 0.51)
  Top 0.254: IC1.2 45.92,20.38 46.99,19.3 49.28,19.3 50.16,18.41 v50.16,14.22
  Bottom 0.406: K2$.10 51.82,12.95 50.55,14.22 v50.16,14.22 46.86,14.22 44.58,11.94 34.04,11.94 M1$.10
TXD
  Bottom 0.406: K1$.4 54.61,26.92 51.82,26.92 50.55,28.19 M1$.25
VCAP
  Top 0.305: IC2.25 25.91,3.68 26.54,3.05 C13.2
VDDTX-RX  (via drill 0.51)
  Top 0.305: IC2.11 25.91,13.63 C8.2 25.32,13.63 v24.77,14.19 | IC2.15 22.43,10.33 21.84,10.92 v21.84,11.68 21.84,11.81 21.57,12.08 FB2.2 20.32,12.14 C17.2 18.61,12.2
  Bottom 0.305: v24.77,14.19 24.77,12.06 24.13,11.43 22.1,11.43 v21.84,11.68
VRAW  (via drill 0.51)
  Top 0.254: v4.47,12.24 4.98,12.24 | R19.2 5.81,1.83 v6.83,1.83 | D4.K 9.6,18.34 9.14,18.8
  Top 0.508: IC3.2 4.09,9.7 4.98,10.59 4.98,12.24 4.98,15.62 6.15,16.79 C18.1 6.15,17.78 7.87,17.78 | 7.87,17.78 8.13,17.78 9.14,18.8 9.55,19.2 9.55,20.4 Q1.2 | 7.87,17.78 v7.87,17.02
  Bottom 0.254: v4.47,12.24 3.83,12.24 1.29,9.7 1.29,4.62 4.09,1.83 v6.83,1.83
  Bottom 0.508: K2$.14 51.05,2.79 49.53,1.27 19.56,1.27 17.27,3.56 17.27,8.13 14.48,10.92 13.72,10.92 12.19,12.45 12.19,16 11.18,17.02 v7.87,17.02

### Text on the board
Bottom: 0bAC | 0403
tPlace: P2 | P1 | LINK | 5 | . | 4 | m | 2 | m | P3 | P0 | n | ACT | 1 | . | 0 | 0 | i | !INT | CTS | SCL | TXD | SDA | RXD | P5 | RTS | P6 | P8 | ERR | P7 | A7 | A5 | SCK | SEL | A3 | MISO | A2 | 3 | . | 6 | 0 | m | m | MOSI | A1 | i | n | A0 | 0 | . | 1 | 4 | 2 | 3v3 | MicroSD | IN | V | GND
bPlace: P2 | P1 | 5-16V | P0 | P3 | !INT | CTS | SCL | TXD | SDA | RXD | outbreak.co/galago | P5 | RTS | P6 | P8 | P7 | A7 | A5 | SCK | SEL | A3 | MISO | A2 | MOSI | A1 | A0 | 3v3 | IN | V | GND
tTest: Galago Ethernet App Board | 0BAC-0403 (Top side)